# EAGLE design RemoteTriggerReceiver (EAGLE 5.11)
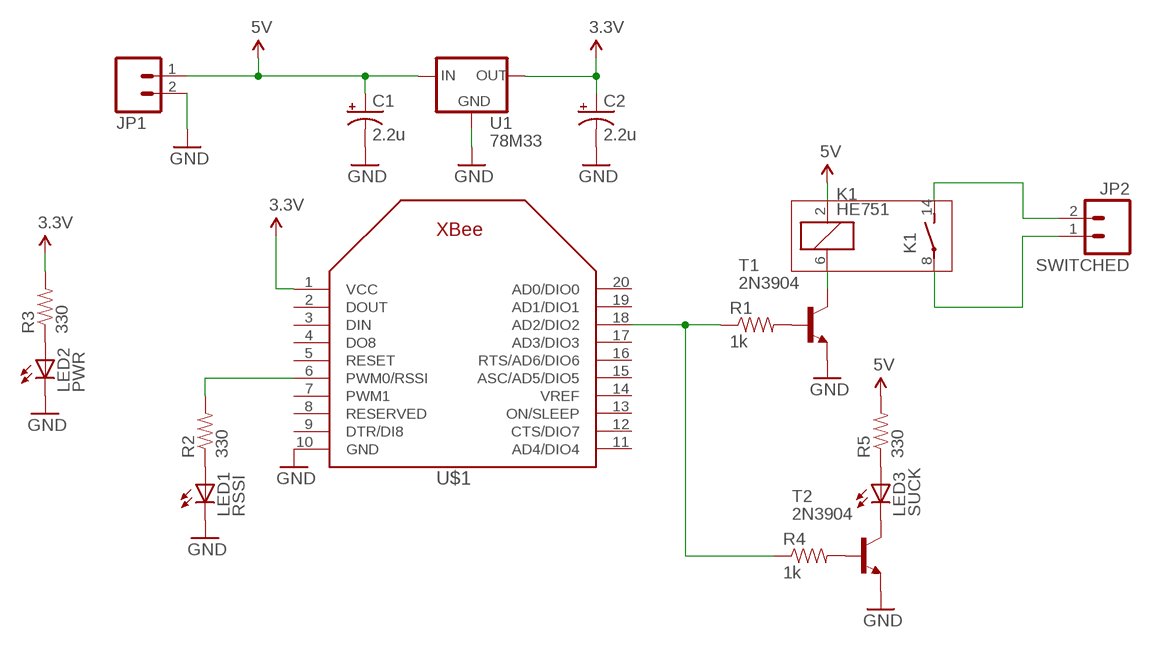
[diagram p0: schematic, sheet 1]

## Parts
C1  2.2u  CAP_POLPTH2  [CPOL-RADIAL-10UF-25V]
C2  2.2u  CAP_POLPTH2  [CPOL-RADIAL-10UF-25V]
JP1  M02POLAR_LOCK  [MOLEX-1X2_LOCK]
JP2  SWITCHED  M02POLAR_LOCK  [MOLEX-1X2_LOCK]
K1  HE751  [HE751]
LED1  RSSI  LED5MM  [LED5MM]
LED2  PWR  LED5MM  [LED5MM]
LED3  SUCK  LED5MM  [LED5MM]
R1  1k  RESISTORAXIAL-0.3  [AXIAL-0.3]
R2  330  RESISTORAXIAL-0.3  [AXIAL-0.3]
R3  330  RESISTORAXIAL-0.3  [AXIAL-0.3]
R4  1k  RESISTORAXIAL-0.3  [AXIAL-0.3]
R5  330  RESISTORAXIAL-0.3  [AXIAL-0.3]
T1  2N3904  [TO92]
T2  2N3904  [TO92]
U1  78M33  V_REG_78XXSINK  [TO220-IGO]
U$1  XBEE  [XBEE]

## Nets
3.3V: C2.1(+) R3.P$2 U1.OUT U$1.1(VCC)
5V: C1.1(+) JP1.1 K1.2 R5.P$2 U1.IN
GND: C1.2(-) C2.2(-) JP1.2 LED1.K(C) LED2.K(C) T1.3(E) T2.3(E) U1.GND U$1.10(GND)
N$1: R1.P$2 T1.2(B)
N$2: R1.P$1 R4.P$1 U$1.18(AD2/DIO2)
N$3: R2.P$2 U$1.6(PWM0/RSSI)
N$4: LED1.A R2.P$1
N$5: K1.6 T1.1(C)
N$6: JP2.2 K1.14(2:S)
N$7: LED2.A R3.P$1
N$8: JP2.1 K1.8(2:P)
N$9: R4.P$2 T2.2(B)
N$10: LED3.K(C) T2.1(C)
N$11: LED3.A R5.P$1
Unconnected: U$1.2(DOUT) U$1.3(DIN) U$1.4(DO8) U$1.5(RESET) U$1.7(PWM1) U$1.8(RESERVED) U$1.9(DTR/DI8) U$1.11(AD4/DIO4) U$1.12(CTS/DIO7) U$1.13(ON/SLEEP) U$1.14(VREF) U$1.15(ASC/AD5/DIO5) U$1.16(RTS/AD6/DIO6) U$1.17(AD3/DIO3) U$1.19(AD1/DIO1) U$1.20(AD0/DIO0)

## Library data of the parts
C1 C2 = SparkFun-20110517:CAP_POL: Capacitor Polarized These are standard SMD and PTH capacitors. Normally 10uF, 47uF, and 100uF in electrolytic and tantalum varieties. Always verify the external diameter of the through hole cap, it varies with capacity, voltage, and manufacturer. The EIA devices should be standard.
JP1 JP2 = SparkFun-20110517:M02: Header 2 Standard 2-pin 0.1" header. Use with straight break away headers (SKU : PRT-00116), right angle break away headers (PRT-00553), swiss pins (PRT-00743), machine pins (PRT-00117), and female headers (PRT-00115). Molex polarized connector foot print use with SKU : PRT-08233 with associated crimp pins and housings.
K1 = relay:HE751: RELAY reed, 1 x norm. open, Hamlin; OC_FARNELL: unknown; OC_NEWARK: unknown
LED1-LED3 = SparkFun-20110517:LED: LEDs Standard schematic elements and footprints for 5mm, 3mm, 1206, and 0603 sized LEDs. 5mm - Spark Fun Electronics SKU : COM-00529 (and others)
R1-R5 = SparkFun-20110517:RESISTOR: Resistor Basic schematic elements and footprints for 0603, 1206, and PTH resistors.
T1 T2 = transistor:2N3904: NPN TRANSISTOR
U1 = SparkFun-20110517:V_REG_78XX: Voltage Regulator Standard 7805 5V regulator. IGO (Input Ground Output). Spark Fun Electronics SKU : COM-00107
U$1 = adafruit:XBEE

## Board
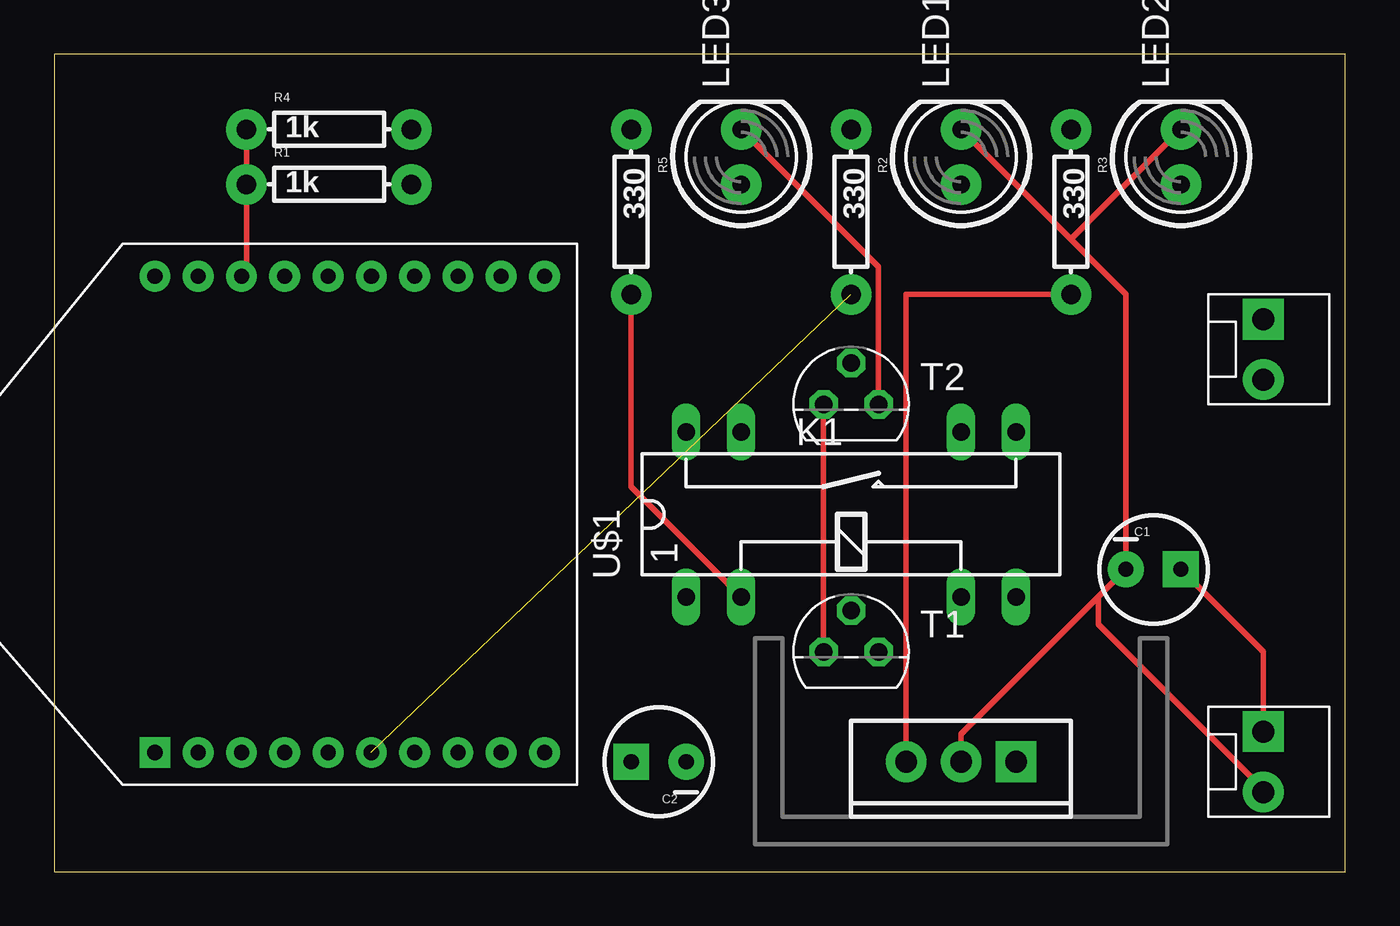
[diagram p1: board, top side]
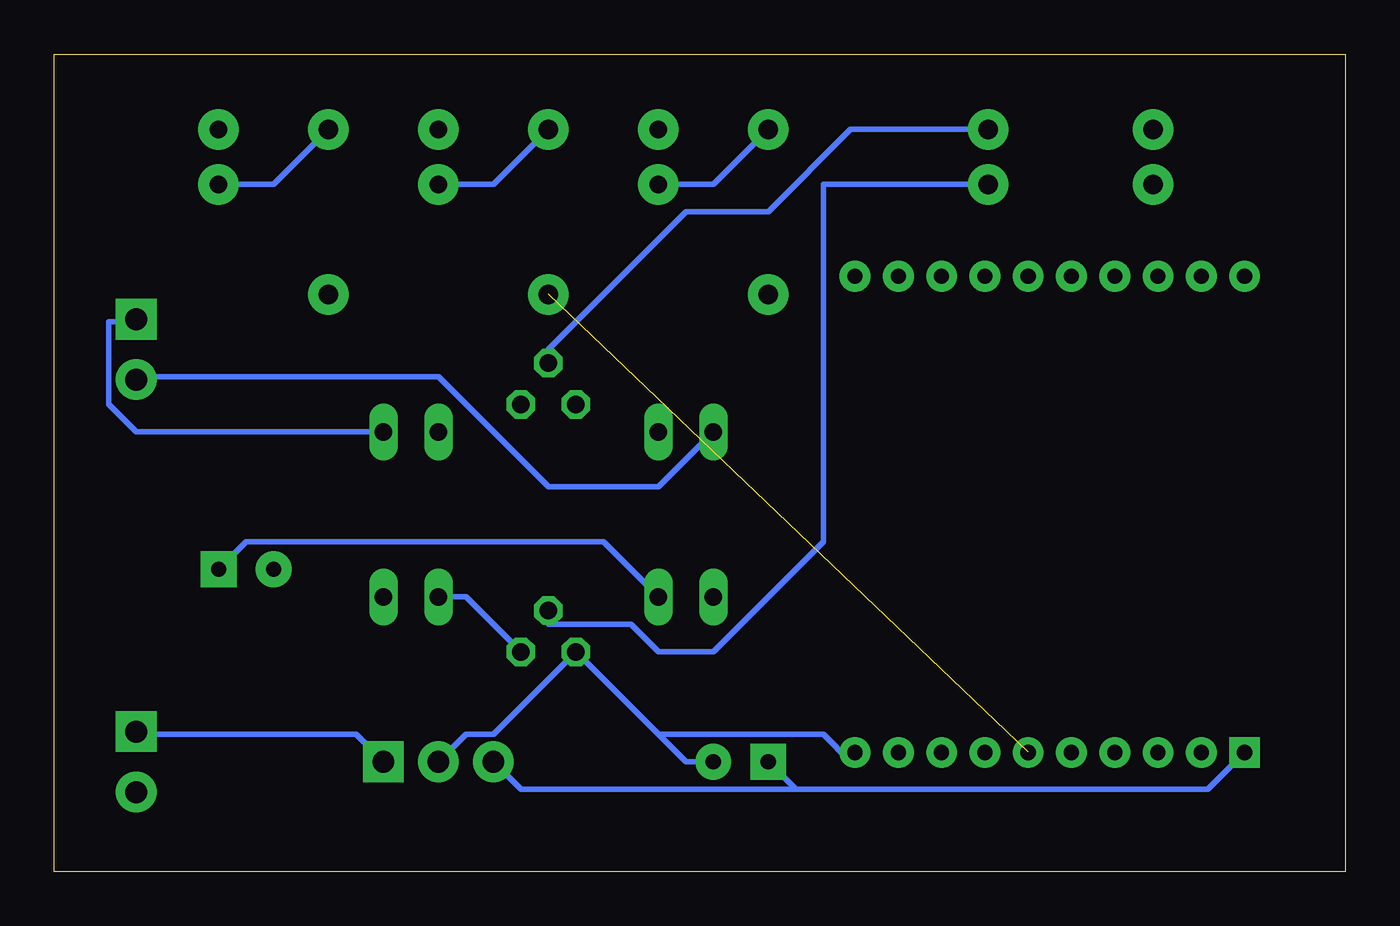
[diagram p2: board, bottom side, seen from below]

Size 59.67 x 37.77 mm. Coordinates in mm from the lower left corner, seen from the top.
Outline: 0,0 59.67,0 59.67,37.77 0,37.77 0,0
Copper layers (1*16): Top 0.035mm / dielectric 1.5mm / Bottom 0.035mm
Design rules "default": minimum track width 10mil, minimum drill 24mil, track to track 8mil, track to pad 8mil, pad to pad 8mil, via to via 8mil, smd to smd 8mil, copper to edge 40mil, drill to drill 8mil, minimum pad ring 10mil, minimum via ring 8mil, stop-mask expansion 4mil, vias tented up to drill 0mil, thermal gap 10mil

### Footprints (pad centres in the part's own frame; a part is rotated, then mirrored left to right if it is on the bottom)
CPOL-RADIAL-10UF-25V = drill 0.7 pad 1.651 square: 1 1.27,0 | drill 0.7 pad 1.651 round: 2 -1.27,0
MOLEX-1X2_LOCK = drill 1.016 pad 1.88 square: 1 -0.127,0 | drill 1.016 pad 1.88 round: 2 2.667,0
HE751 = drill 0.813 long: 1 -7.62,-3.81; 2 -5.08,-3.81; 6 5.08,-3.81; 7 7.62,-3.81; 8 7.62,3.81; 9 5.08,3.81; 13 -5.08,3.81; 14 -7.62,3.81
LED5MM = drill 0.813 pad 1.88 round: A -1.27,0; K 1.27,0
AXIAL-0.3 = drill 0.9 pad 1.88 round: P$1 -3.81,0; P$2 3.81,0
TO92 = drill 0.813 octagon: 1 1.27,0; 2 0,1.905; 3 -1.27,0
TO220-IGO = drill 1 pad 1.88 round: GND 0,0; OUT 2.54,0 | drill 1 pad 1.88 square: IN -2.54,0
XBEE = drill 0.7 pad 1.422 square: 1 -11,5.5 | drill 0.7 pad 1.422 round: 2 -11,3.5; 3 -11,1.5; 4 -11,-0.5; 5 -11,-2.5; 6 -11,-4.5; 7 -11,-6.5; 8 -11,-8.5; 9 -11,-10.5; 10 -11,-12.5; 11 11,-12.5; 12 11,-10.5; 13 11,-8.5; 14 11,-6.5; 15 11,-4.5; 16 11,-2.5; 17 11,-0.5; 18 11,1.5; 19 11,3.5; 20 11,5.5

### Placement (x,y rotation side)
C1  50.8,13.97 0 top
C2  27.94,5.08 180 top
JP1  55.88,6.35 270 top
JP2  55.88,25.4 270 top
K1  36.83,16.51 0 top
LED1  41.91,33.02 90 top
LED2  52.07,33.02 90 top
LED3  31.75,33.02 90 top
R1  12.7,31.75 0 top
R2  36.83,30.48 270 top
R3  46.99,30.48 270 top
R4  12.7,34.29 0 top
R5  26.67,30.48 270 top
T1  36.83,10.16 0 top
T2  36.83,21.59 0 top
U1  41.91,5.08 180 top
U$1  10.16,16.51 90 top

### Tracks (layer width: path | path; a pad name or v marks a point on that pad's centre or on a via)
3.3V
  Top 0.254: R3.P$2 39.37,26.67 U1.OUT
  Bottom 0.254: 25.4,3.81 6.35,3.81 5.08,5.08 U$1.1 | 25.4,3.81 C2.1 | U1.OUT 38.1,3.81 25.4,3.81
5V
  Top 0.254: K1.2 26.67,17.78 R5.P$2 | C1.1 55.88,10.16 JP1.1 | JP1.1 55.88,6.35 JP1.1
  Bottom 0.254: U1.IN 45.72,6.35 55.88,6.35 JP1.1 | K1.2 34.29,15.24 50.8,15.24 C1.1
GND
  Top 0.254: T1.3 T2.3 | 48.26,12.7 41.91,6.35 U1.GND | 48.26,12.7 C1.2 49.53,26.67 46.99,29.21 | 48.26,12.7 48.26,11.43 55.88,3.81 JP1.2 | 46.99,29.21 LED1.K | 46.99,29.21 LED2.K
  Bottom 0.254: 31.75,6.35 30.48,5.08 C2.2 | 31.75,6.35 T1.3 39.37,6.35 40.64,6.35 U1.GND | 31.75,6.35 24.13,6.35 22.86,5.08 U$1.10
N$1
  Bottom 0.254: R1.P$2 24.13,31.75 24.13,15.24 29.21,10.16 31.75,10.16 33.02,11.43 36.83,11.43 T1.2
N$2
  Top 0.254: U$1.18 8.89,27.94 R1.P$1 R4.P$1
N$3  (1 unrouted)
N$4
  Bottom 0.254: R2.P$1 39.37,31.75 LED1.A
N$5
  Bottom 0.254: T1.1 40.64,12.7 K1.6
N$6
  Bottom 0.254: K1.14 31.75,17.78 36.83,17.78 41.91,22.86 55.88,22.86 JP2.2
N$7
  Bottom 0.254: R3.P$1 49.53,31.75 LED2.A
N$8
  Bottom 0.254: K1.8 55.88,20.32 57.15,21.59 57.15,25.4 55.88,25.4 JP2.1
N$9
  Bottom 0.254: R4.P$2 22.86,34.29 26.67,30.48 30.48,30.48 36.83,24.13 T2.2
N$10
  Top 0.254: T2.1 38.1,27.94 LED3.K
N$11
  Bottom 0.254: R5.P$1 29.21,31.75 LED3.A